# EAGLE schematic rts (EAGLE 6.2)
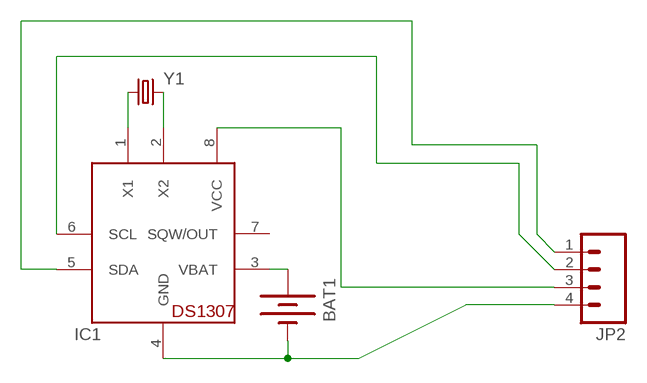
[diagram p0: schematic, sheet 1]

## Parts
BAT1  BATTERYFOB  [BATTERY_20MM_PTH_COMPACT]
IC1  DS1307  [DIL08]
JP2  M04LONGPADS  [1X04_LONGPADS]
Y1  CRYSTALTC38H  [TC38H]

## Nets
GND: BAT1.2(-) IC1.4(GND) JP2.4
N$1: IC1.2(X2) Y1.2
N$2: IC1.1(X1) Y1.1
N$6: IC1.8(VCC) JP2.3
N$18: BAT1.1(+) IC1.3(VBAT)
N$19: IC1.5(SDA) JP2.1
N$21: IC1.6(SCL) JP2.2
Unconnected: IC1.7(SQW/OUT)

## Library data of the parts
BAT1 = SparkFun:BATTERY: Battery Holders Various common sizes : AA, AAA, 20mm coin cell and 12mm coin cell.
IC1 = adafruit:DS1307: DS1307 Real time clock (RTC) with battery backup ability. Talk to it via i2c
JP2 = SparkFun-Connectors:M04: Header 4 Standard 4-pin 0.1" header. Use with straight break away headers (SKU : PRT-00116), right angle break away headers (PRT-00553), swiss pins (PRT-00743), machine pins (PRT-00117), and female headers (PRT-00115). Molex polarized connector foot print use with SKU : PRT-08231 with associated crimp pins and housings. 1MM SMD Version SKU: PRT-10208
Y1 = SparkFun-FreqCtrl:CRYSTAL: Various standard crystals. Proven footprints. Spark Fun Electronics SKU : COM-00534